# EAGLE design Breadboard Power Supply v10 (EAGLE 4.16)
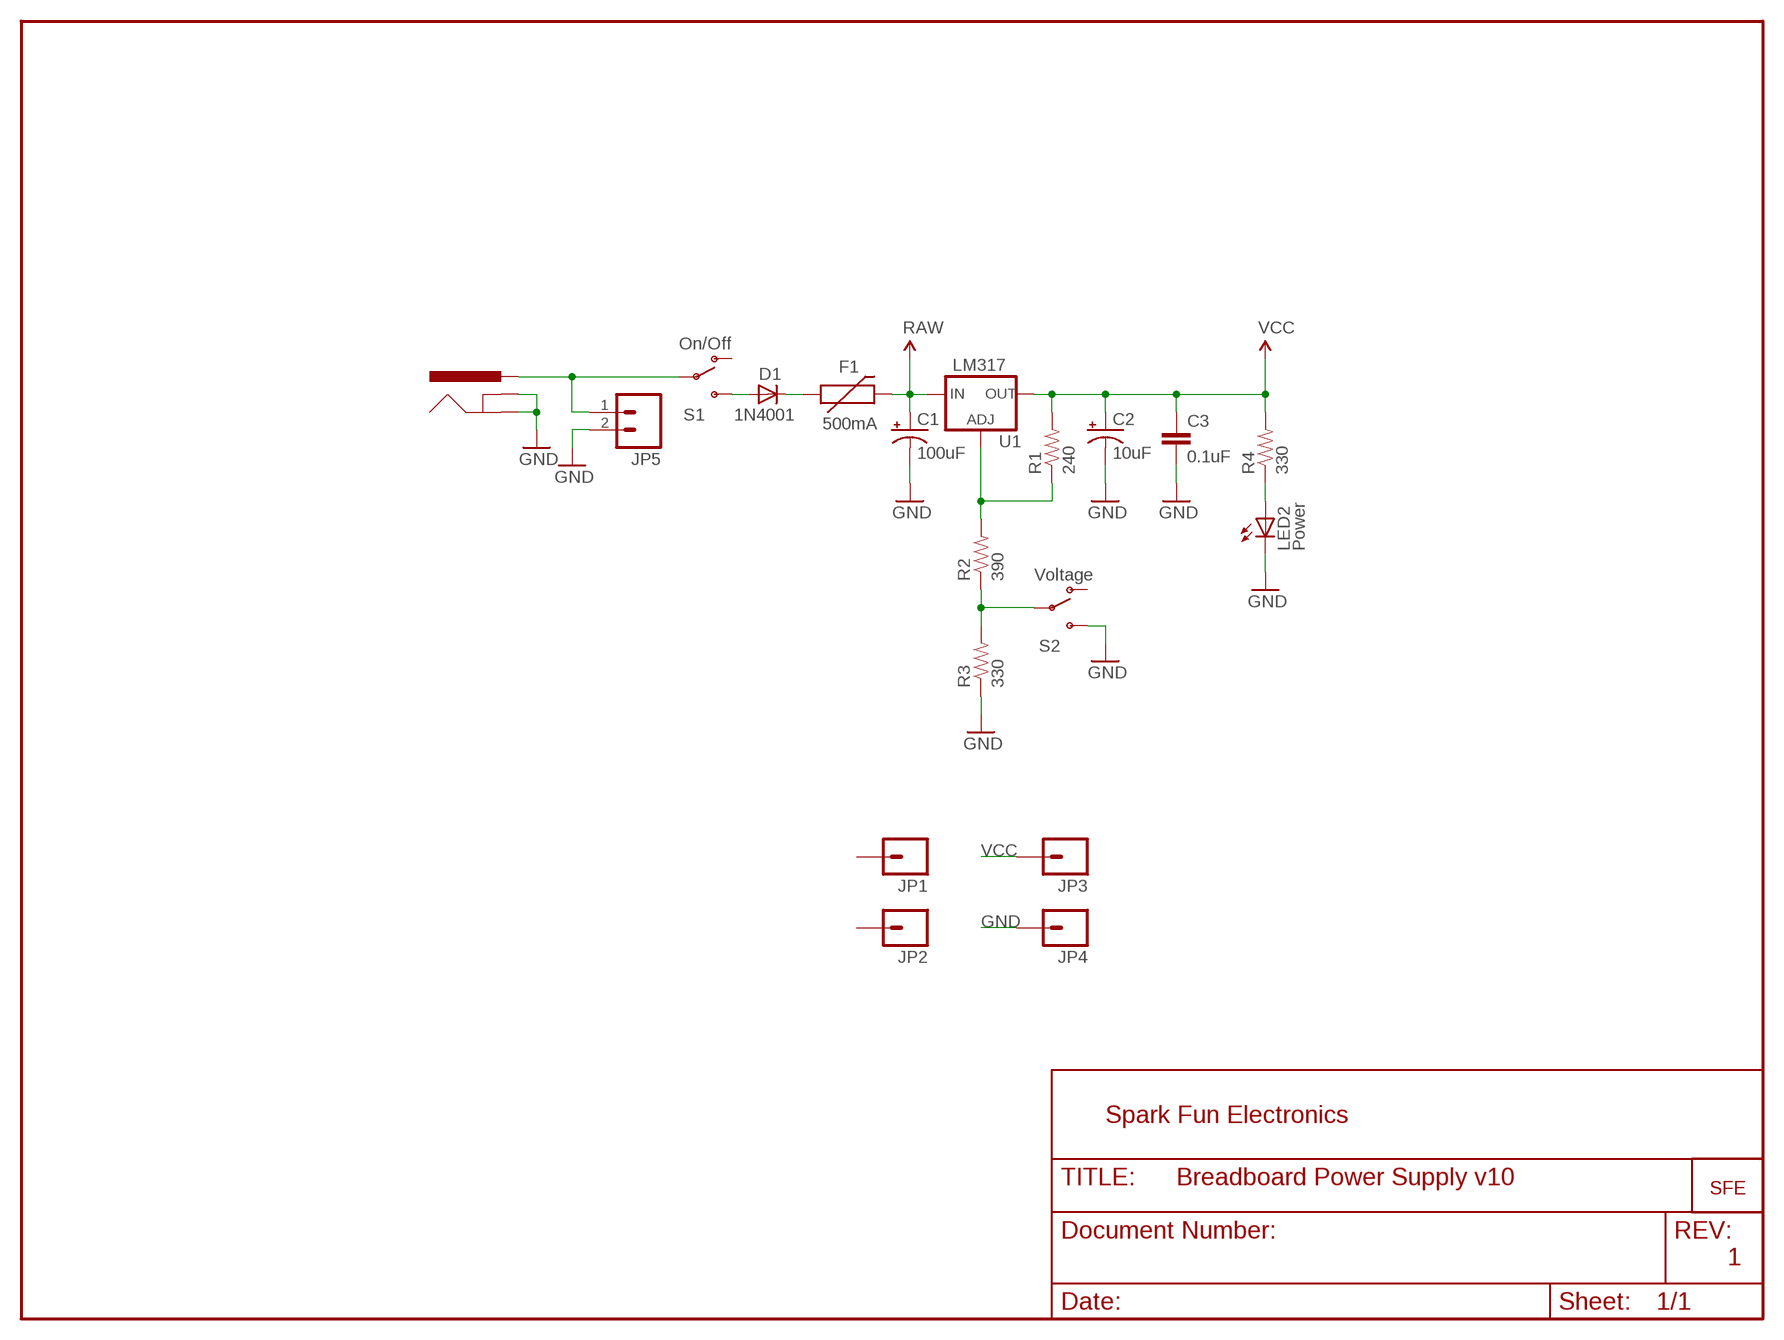
[diagram p0: schematic, sheet 1]

## Parts
C1  100uF  CAP_POLPTH1  [CPOL-RADIAL-100UF-25V]
C2  10uF  CAP_POLPTH2  [CPOL-RADIAL-10UF-25V]
C3  0.1uF  CAPPTH2  [CAP-PTH-SMALL2]
D1  1N4001  DIODEPTH  [DIODE-0.4]
F1  500mA  PTCPTH  [PTC]
J1  POWER_JACKPTH  [POWER_JACK_PTH]
JP1  M01PTH  [1X01]
JP2  M01PTH  [1X01]
JP3  M01PTH  [1X01]
JP4  M01PTH  [1X01]
JP5  M02PTH  [1X02]
LED2  Power  LED5MM  [LED5MM]
R1  240  RESISTORPTH1  [AXIAL-0.3]
R2  390  RESISTORPTH1  [AXIAL-0.3]
R3  330  RESISTORPTH1  [AXIAL-0.3]
R4  330  RESISTORPTH1  [AXIAL-0.3]
S1  On/Off  SWITCH-SPSTPTH  [SWITCH-SPST]
S2  Voltage  SWITCH-SPSTPTH  [SWITCH-SPST]
U1  LM317  V_REG_317SINK  [TO220-ADJ]
U$1  LOGO-SFESK  [SFE-LOGO-FLAME]

## Nets
GND: C1.2(-) C2.2(-) C3.2 J1.GND J1.GNDBREAK JP4.1 JP5.2 LED2.K(C) R3.P$1 S2.3(S)
N$1: D1.C F1.P$1
N$2: D1.A S1.3(S)
N$3: J1.PWR JP5.1 S1.2(P)
N$4: R2.P$1 R3.P$2 S2.2(P)
N$5: R1.P$1 R2.P$2 U1.ADJ
N$8: LED2.A R4.P$1
RAW: C1.1(+) F1.P$2 U1.IN
VCC: C2.1(+) C3.1 JP3.1 R1.P$2 R4.P$2 U1.OUT
Unconnected: JP1.1 JP2.1 S1.1(O) S2.1(O)

## Notes on the sheet
- Spark Fun Electronics
- 1

## Library data of the parts
C1 C2 = SparkFun:CAP_POL: Capacitor Polarized These are standard SMD and PTH capacitors. Normally 10uF, 47uF, and 100uF in electrolytic and tantalum varieties. Always verify the external diameter of the through hole cap, it varies with capacity, voltage, and manufacturer. The EIA devices should be standard.
C3 = SparkFun:CAP: Capacitor Standard 0603 ceramic capacitor, and 0.1" leaded capacitor.
D1 = SparkFun:DIODE: Diode These are standard reverse protection diodes and small signal diodes. SMA package can handle up to about 1A. SOD-323 can handle about 200mA. What the SOD-323 package when ordering, there are some mfgs out there that are 5-pin packages.
F1 = SparkFun:PTC: Resettable Fuse PTC Resettable Fuse. Spark Fun Electronics SKU : COM-08357
J1 = SparkFun:POWER_JACK: Power Jack This is the standard 5.5mm barrel jack for power. The PTH is the most common, proven, reliable, footprint. All others are experimental. The Slot footprint only works if the mill layer is transmitted to the PCB fab house so be warned. Spark Fun Electronics SKU : PRT-00119. Mating wall wart : TOL-00298 (and others)
JP1-JP4 = SparkFun:M01: Header 1 Standard 1-pin 0.1" header. Use with straight break away headers (SKU : PRT-00116), right angle break away headers (PRT-00553), swiss pins (PRT-00743), machine pins (PRT-00117), and female headers (PRT-00115).
JP5 = SparkFun:M02: Header 2 Standard 2-pin 0.1" header. Use with straight break away headers (SKU : PRT-00116), right angle break away headers (PRT-00553), swiss pins (PRT-00743), machine pins (PRT-00117), and female headers (PRT-00115). Molex polarized connector foot print use with SKU : PRT-08233 with associated crimp pins and housings.
LED2 = SparkFun-Nate:LED
R1-R4 = SparkFun:RESISTOR: Resistor Basic schematic elements and footprints for 0603, 1206, and PTH 1/10th watt (small) resistors.
S1 S2 = SparkFun:SWITCH-SPST: SPST Switch Simple slide switch. Spark Fun Electronics SKU : COM-00102
U1 = SparkFun:V_REG_317: Voltage Regulator Standard LM317 adjustable voltage regulator. AOI (Adjust Output Input). Google 'LM317 Calculator' for easy to use app to get the two resistor values needed. 240/720 for 5V output. 240/390 for 3.3V output. Spark Fun Electronics SKU : COM-00527
U$1 = SparkFun:LOGO-SFE: Spark Fun Electronics PCB Logo This is the standard Spark Fun Electronics PCB logo.

## Net classes
0 default: width 0.254 mm
1 power: width 0.508 mm

## Board
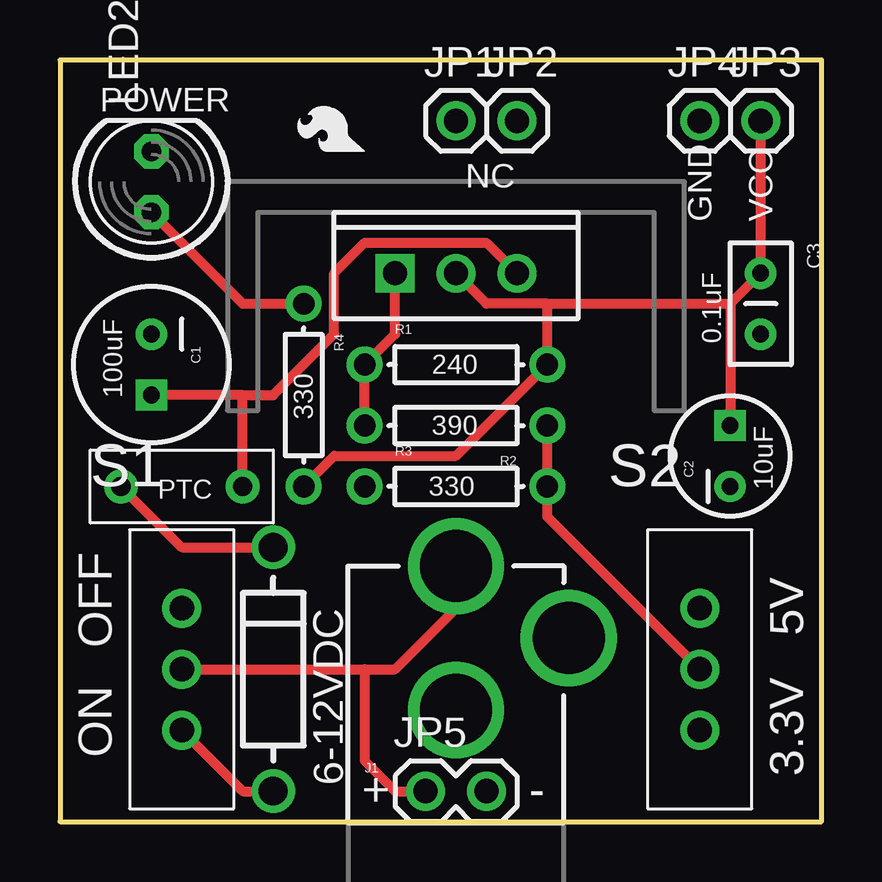
[diagram p1: board, top side]
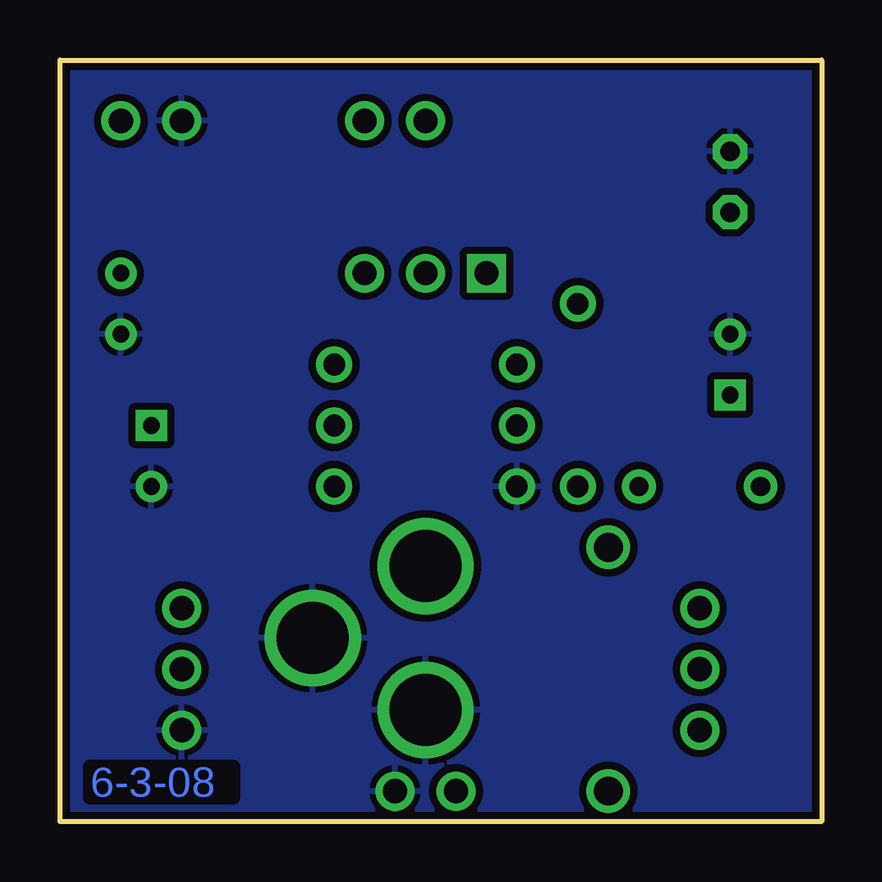
[diagram p2: board, bottom side, seen from below]

Size 31.75 x 31.75 mm. Coordinates in mm from the lower left corner, seen from the top.
Outline: 0,0 31.75,0 31.75,31.75 0,31.75 0,0
Copper layers (1*16): Top 0.035mm / dielectric 1.5mm / Bottom 0.035mm
Design rules "SparkFun": minimum track width 8mil, minimum drill 20mil, track to track 8mil, track to pad 8mil, pad to pad 8mil, via to via 8mil, smd to smd 8mil, copper to edge 10mil, drill to drill 8mil, minimum pad ring 12mil, minimum via ring 10mil, stop-mask expansion 4mil, vias tented up to drill 20mil, thermal gap 10mil

### Footprints (pad centres in the part's own frame; a part is rotated, then mirrored left to right if it is on the bottom)
CPOL-RADIAL-100UF-25V = drill 0.7 square: 1 1.27,0 | drill 0.7 round: 2 -1.27,0
CPOL-RADIAL-10UF-25V = drill 0.7 square: 1 1.27,0 | drill 0.7 round: 2 -1.27,0
CAP-PTH-SMALL2 = drill 0.7 round: 1 0,0; 2 2.54,0
DIODE-0.4 = drill 1.2 round: A 0,0; C 10.16,0
PTC = drill 0.8 round: P$1 -2.54,0; P$2 2.54,0
POWER_JACK_PTH = drill 2.997 round: GND 0,7.7; GNDBREAK 4.7,10.7; PWR 0,13.7
1X01 = drill 1.016 round: 1 0,0
1X02 = drill 1.016 round: 1 0,0; 2 2.54,0
LED5MM = drill 0.813 octagon: A -1.27,0; K 1.27,0
AXIAL-0.3 = drill 0.9 round: P$1 -3.81,0; P$2 3.81,0
SWITCH-SPST = drill 1.016 round: 1 0,2.54; 2 0,0; 3 0,-2.54
TO220-ADJ = drill 1 square: ADJ -2.54,0 | drill 1 round: IN 2.54,0; OUT 0,0

### Placement (x,y rotation side)
C1  3.81,19.05 270 top
C2  27.94,15.24 90 top
C3  29.21,22.86 270 top
D1  8.89,1.27 90 top
F1  5.08,13.97 0 top
J1  16.51,-3.05 0 top
JP1  16.51,29.21 0 top
JP2  19.05,29.21 0 top
JP3  29.21,29.21 0 top
JP4  26.67,29.21 0 top
JP5  15.24,1.27 0 top
LED2  3.81,26.67 90 top
R1  16.51,19.05 0 top
R2  16.51,16.51 180 top
R3  16.51,13.97 0 top
R4  10.16,17.78 270 top
S1  5.08,6.35 0 top
S2  26.67,6.35 0 top
U1  16.51,22.86 0 top
U$1  12.7,27.94 90 top

### Tracks (layer width: path | path; a pad name or v marks a point on that pad's centre or on a via)
GND
  pour Bottom (isolate 0.305): 0,31.75 31.75,31.75 31.75,0 0,0
N$1
  Top 0.406: D1.C 5.08,11.43 F1.P$1
N$2
  Top 0.406: D1.A 7.62,1.27 S1.3
N$3
  Top 0.406: S1.2 12.7,6.35 | 12.7,6.35 13.97,6.35 16.51,8.89 J1.PWR | JP5.1 13.97,1.27 12.7,2.54 12.7,6.35
N$4
  Top 0.406: R2.P$1 R3.P$2 20.32,12.7 S2.2
N$5
  Top 0.406: U1.ADJ 13.97,20.32 R1.P$1 R2.P$2
N$8
  Top 0.406: R4.P$1 7.62,21.59 LED2.A
RAW
  Top 0.406: 7.62,17.78 C1.1 | 7.62,17.78 8.89,17.78 11.43,20.32 11.43,22.86 12.7,24.13 17.78,24.13 U1.IN | F1.P$2 7.62,17.78
VCC
  Top 0.406: 27.94,21.59 C2.1 | 27.94,21.59 C3.1 JP3.1 | 20.32,21.59 17.78,21.59 U1.OUT | 20.32,21.59 27.94,21.59 | 20.32,21.59 R1.P$2 16.51,15.24 11.43,15.24 R4.P$2

### Text on the board
Bottom: 6-3-08
tPlace: POWER | NC | GND | VCC | PTC | 5V | OFF | ON | 6-12VDC | 3.3V | + | -